# Altium schematic sheet INDEX.SchDoc
size 420 x 297 mm; Date: 21/02/2025; Address1: BEE-PC1; SheetNumber: 1; SheetTotal: 4
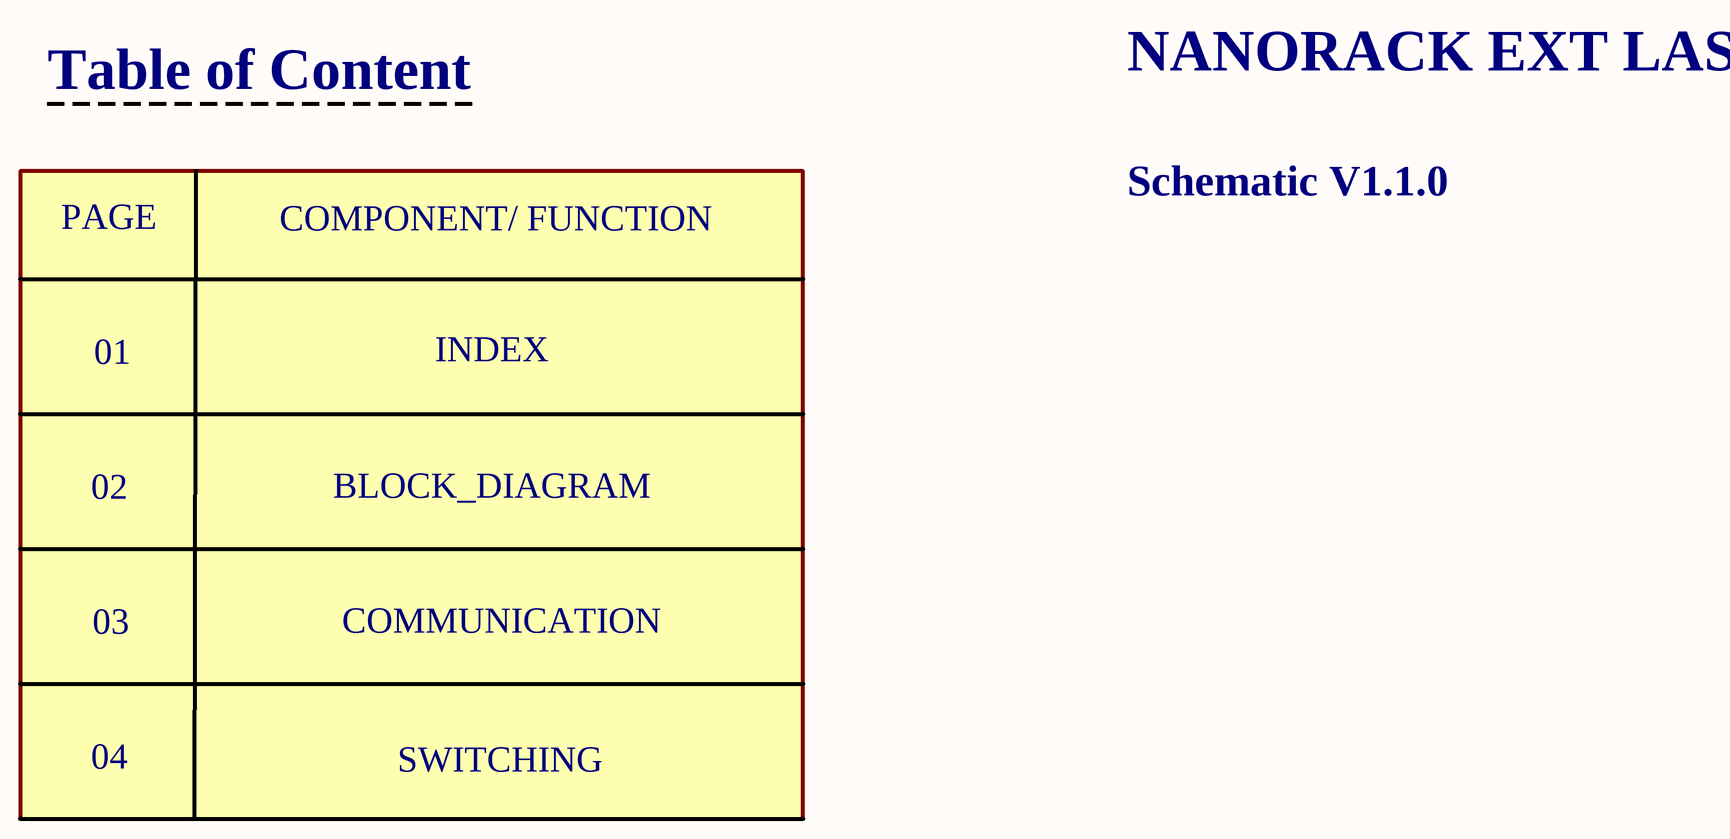
[diagram p0: INDEX.SchDoc]

## Notes on the sheet
- NANORACK EXT LASER
- Table of Content
- COMPONENT/ FUNCTION
- Schematic V1.1.0
- PAGE
- INDEX
- 01
- BLOCK_DIAGRAM
- 02
- COMMUNICATION
- 03
- SWITCHING
- 04
- Project:
- Sub-system:
- Design by:
- SAMY VE
- BAO BUI Q.
- Sheet title:
- Sheet
- A3
- of
- Checked by:
- Approved by:
- VU PHAM
- Revision:
- Document No:
- V1.1.0
- Size:
- Date: